# EAGLE design Controller V1.1 (EAGLE 8.4.1)
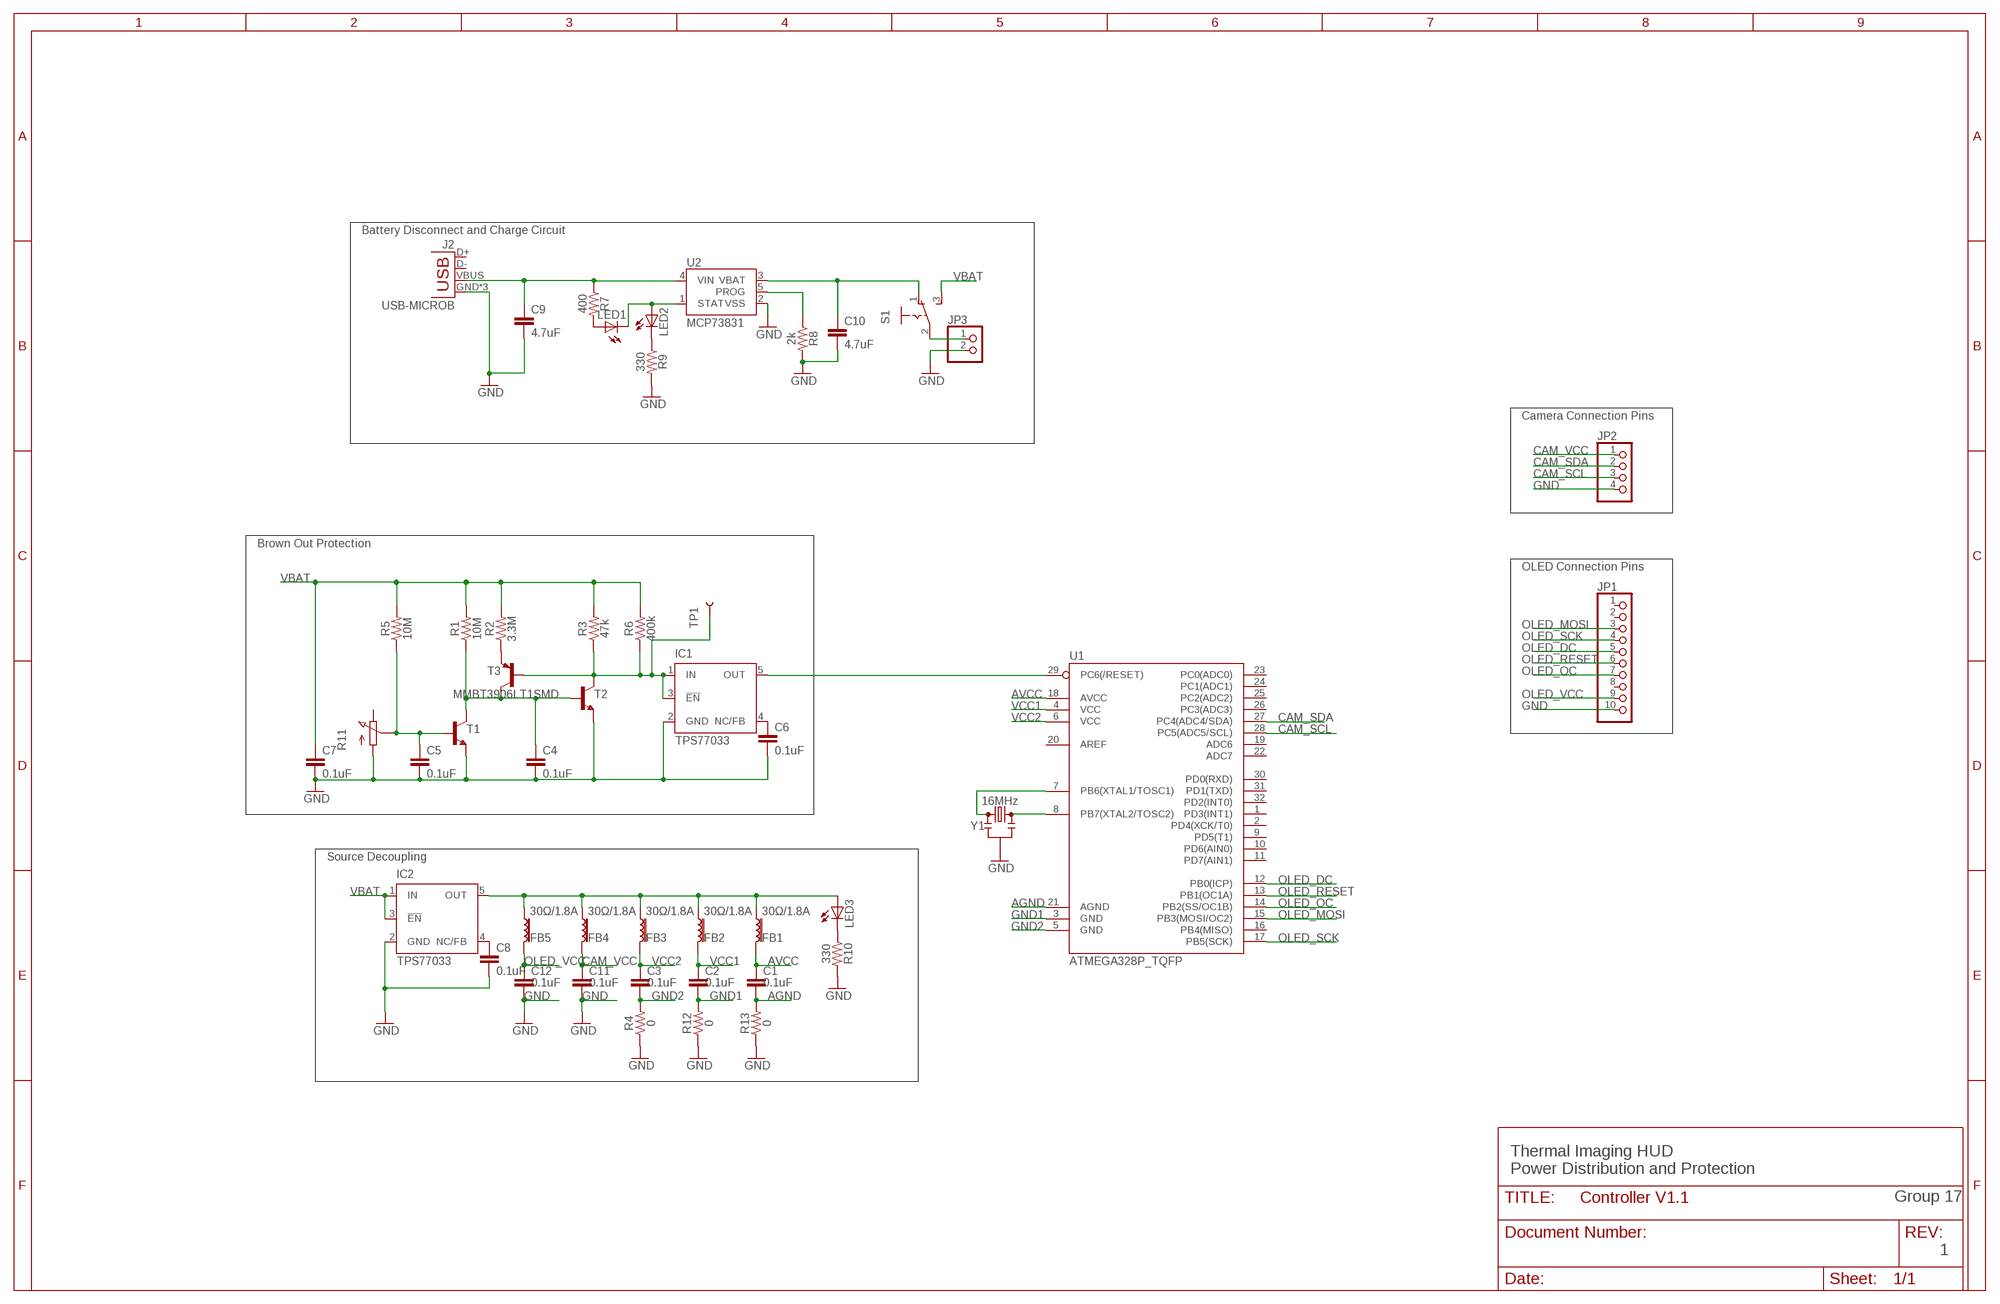
[diagram p0: schematic, sheet 1]

## Parts
C1  0.1uF  0.1UF-0603-25V-5%  [0603]
C2  0.1uF  0.1UF-0603-25V-5%  [0603]
C3  0.1uF  0.1UF-0603-25V-5%  [0603]
C4  0.1uF  0.1UF-0603-25V-5%  [0603]
C5  0.1uF  0.1UF-0603-25V-5%  [0603]
C6  0.1uF  0.1UF-0603-25V-5%  [0603]
C7  0.1uF  0.1UF-0603-25V-5%  [0603]
C8  0.1uF  0.1UF-0603-25V-5%  [0603]
C9  4.7uF  0.1UF-0603-25V-5%  [0603]
C10  4.7uF  0.1UF-0603-25V-5%  [0603]
C11  0.1uF  0.1UF-0603-25V-5%  [0603]
C12  0.1uF  0.1UF-0603-25V-5%  [0603]
FB1  30Ω/1.8A  FERRITE_BEAD-0603  [0603]
FB2  30Ω/1.8A  FERRITE_BEAD-0603  [0603]
FB3  30Ω/1.8A  FERRITE_BEAD-0603  [0603]
FB4  30Ω/1.8A  FERRITE_BEAD-0603  [0603]
FB5  30Ω/1.8A  FERRITE_BEAD-0603  [0603]
IC1  TPS77033  [SOT23-DBV]
IC2  TPS77033  [SOT23-DBV]
J2  USB-MICROB  [USB-MICROB]
JP1  PINHD-1X10/90  [1X10/90]
JP2  PINHD-1X4/90  [1X04/90]
JP3  PINHD-1X2/90  [1X02/90]
LED1  LS_T679-D2E2-1  [PLCC2]
LED2  LG_T679-E1F1-1  [PLCC2]
LED3  LG_T679-E1F1-1  [PLCC2]
R1  10M  10MOHM-0603-1/10W-5%  [0603]
R2  3.3M  10MOHM-0603-1/10W-5%  [0603]
R3  47k  10MOHM-0603-1/10W-5%  [0603]
R4  0  0OHM-0603-1/10W-5%  [0603]
R5  10M  10MOHM-0603-1/10W-5%  [0603]
R6  400k  10MOHM-0603-1/10W-5%  [0603]
R7  400  10MOHM-0603-1/10W-5%  [0603]
R8  2k  10MOHM-0603-1/10W-5%  [0603]
R9  330  10MOHM-0603-1/10W-5%  [0603]
R10  330  10MOHM-0603-1/10W-5%  [0603]
R11  PC25  [PC25]
R12  0  0OHM-0603-1/10W-5%  [0603]
R13  0  0OHM-0603-1/10W-5%  [0603]
S1  255SB  [255SB]
T1  MMBT3904LT1-NPN-SOT23-BEC  [SOT23-BEC]
T2  MMBT3904LT1-NPN-SOT23-BEC  [SOT23-BEC]
T3  MMBT3906LT1SMD  [SOT23-BEC]
TP1  TEST-POINT3X5  [PAD.03X.05]
U1  ATMEGA328P_TQFP  [TQFP32-08]
U2  MCP73831  [SOT23-5]
Y1  16MHz  RESONATOR-16MHZSMD_3.2X1.3  [RESONATOR-SMD-3.2X1.3]

## Nets
AGND: C1.2 R13.2 U1.21(AGND)
AVCC: C1.1 FB1.2 U1.18(AVCC)
CAM_SCL: JP2.3 U1.28(PC5(ADC5/SCL))
CAM_SDA: JP2.2 U1.27(PC4(ADC4/SDA))
CAM_VCC: C11.1 FB4.2 JP2.1
GND: C4.2 C5.2 C6.2 C7.2 C8.2 C9.2 C10.2 C11.2 C12.2 IC1.2(GND) IC2.2(GND) J2.GND J2.MT1(GND) J2.MT2(GND) JP1.10 JP2.4 JP3.2 R4.1 R8.2 R9.2 R10.2 R11.A R12.1 R13.1 T1.E T2.E U2.2(VSS) Y1.2
GND1: C2.2 R12.2 U1.3(GND)
GND2: C3.2 R4.2 U1.5(GND)
LIPO_POS: JP3.1 S1.2(P)
N$1: IC1.1(IN) IC1.3(!EN) R3.1 R6.1 T2.C T3.B TP1.P$1
N$2: C5.1 R5.1 R11.S T1.B
N$3: IC1.5(OUT) U1.29(PC6(/RESET))
N$4: C4.1 R1.1 T1.C T2.B T3.C
N$5: R2.1 T3.E
N$6: LED1.C LED2.A U2.1(STAT)
N$7: C6.1 IC1.4(NC/FB)
N$8: FB1.1 FB2.1 FB3.1 FB4.1 FB5.1 IC2.5(OUT) LED3.A
N$9: C8.1 IC2.4(NC/FB)
N$10: LED1.A R7.2
N$11: C9.1 J2.VBUS R7.1 U2.4(VIN)
N$12: R8.1 U2.5(PROG)
N$13: C10.1 S1.1(O) U2.3(VBAT)
N$15: U1.7(PB6(XTAL1/TOSC1)) Y1.1
N$16: U1.8(PB7(XTAL2/TOSC2)) Y1.3
N$17: LED3.C R10.1
N$18: LED2.C R9.1
OLED_DC: JP1.5 U1.12(PB0(ICP))
OLED_MOSI: JP1.3 U1.15(PB3(MOSI/OC2))
OLED_OC: JP1.7 U1.14(PB2(SS/OC1B))
OLED_RESET: JP1.6 U1.13(PB1(OC1A))
OLED_SCK: JP1.4 U1.17(PB5(SCK))
OLED_VCC: C12.1 FB5.2 JP1.9
VBAT: C7.1 IC2.1(IN) IC2.3(!EN) R1.2 R2.2 R3.2 R5.2 R6.2 S1.3(S)
VCC1: C2.1 FB2.2 U1.4(VCC)
VCC2: C3.1 FB3.2 U1.6(VCC)
Unconnected: J2.D+ J2.D- JP1.1 JP1.2 JP1.8 R11.E U1.1(PD3(INT1)) U1.2(PD4(XCK/T0)) U1.9(PD5(T1)) U1.10(PD6(AIN0)) U1.11(PD7(AIN1)) U1.16(PB4(MISO)) U1.19(ADC6) U1.20(AREF) U1.22(ADC7) U1.23(PC0(ADC0)) U1.24(PC1(ADC1)) U1.25(PC2(ADC2)) U1.26(PC3(ADC3)) U1.30(PD0(RXD)) U1.31(PD1(TXD)) U1.32(PD2(INT0))

## Notes on the sheet
- Battery Disconnect and Charge Circuit
- Camera Connection Pins
- Brown Out Protection
- OLED Connection Pins
- Source Decoupling
- Thermal Imaging HUD
  Power Distribution and Protection
- Group 17
- 1

## Library data of the parts
C1-C8 C11 C12 = SparkFun-Capacitors:0.1UF: 0.1µF ceramic capacitors A capacitor is a passive two-terminal electrical component used to store electrical energy temporarily in an electric field.; PROD_ID: CAP-08604
C9 C10 = SparkFun-Capacitors:0.1UF: 0.1µF ceramic capacitors A capacitor is a passive two-terminal electrical component used to store electrical energy temporarily in an electric field.; PROD_ID: CAP-08604; VALUE: 0.1uF
FB1-FB5 = SparkFun-Coils:FERRITE_BEAD: Ferrite Bead (blocks, cores, rings, chokes, etc.) Inductor with layers of ferrite used to suppress high frequencies. Often used to isolate high frequency noise. SparkFun Products: IOIO-OTG - V2.2 <https://www.sparkfun.com/products/13613> SparkFun SAMD21 Mini Breakout <https://www.sparkfun.com/products/13664> SparkFun 6 Degrees of Freedom Breakout - LSM6DS3 <https://www.sparkfun.com/products/13339> SparkFun SAMD21 Dev Breakout <https://www.sparkfun.com/products/13672>; PROD_ID: NDUC-07859
IC1 IC2 = texas:TPS770*: ULTRALOW-POWER 50-mA LOW-DROPOUT LINEAR REGULATORS 50-mA Low-Dropout Regulator Source: http://focus.ti.com/lit/ds/symlink/tps77001.pdf; MF: TEXAS INSTRUMENTS; MPN: TPS77033DBVT; OC_FARNELL: 8461570; OC_NEWARK: 77C1187
J2 = SparkFun-Retired:USB: USB Connectors USB-B-PTH is fully proven SKU : PRT-00139/CONN-08278 USB-miniB is fully proven SKU : PRT-00587 USB-A-PCB is untested. USB-A-H is throughly reviewed, but untested. Spark Fun Electronics SKU : PRT-00437 USB-B-SMT is throughly reviewed, but untested. Needs silkscreen touching up. USB-A-S has not been used/tested USB-MB-H has not been used/tested USB-MICROB has been used. CONN-09505; PROD_ID: CONN-09505
JP1 = pinhead:PINHD-1X10: PIN HEADER
JP2 = pinhead:PINHD-1X4: PIN HEADER
JP3 = pinhead:PINHD-1X2: PIN HEADER
LED1 = led:*_T679-?-1: LC TOPLED® Low Current LED Source: http://catalog.osram-os.com .. LG_LS_LY_T679_OBS.pdf; COLOR: super-red
LED2 LED3 = led:*_T679-?-1: LC TOPLED® Low Current LED Source: http://catalog.osram-os.com .. LG_LS_LY_T679_OBS.pdf; COLOR: green
R1 R5 = SparkFun-Resistors:10MOHM: RES-09327; PROD_ID: RES-08283
R2 R3 R6-R10 = SparkFun-Resistors:10MOHM: RES-09327; PROD_ID: RES-08283; VALUE: 10M
R4 R12 R13 = SparkFun-Resistors:0OHM: 0Ω resistor A resistor is a passive two-terminal electrical component that implements electrical resistance as a circuit element. Resistors act to reduce current flow, and, at the same time, act to lower voltage levels within circuits. - Wikipedia; PROD_ID: RES-08609
R11 = pot-vitrohm:PC25: VITROHM POTENTIOMETER; MF: CLAROSTAT; MPN: 308NPC25KS; OC_FARNELL: 1440998; OC_NEWARK: 03F7518
S1 = switch:255SB: SLIDING SWITCH Distributor Buerklin, 11G810
T1 T2 = transistor-neu-to92:*-NPN-: NPN Transistror
T3 = transistor-pnp:MMBT3906*: PNP Transistror
TP1 = SparkFun-Connectors:TEST-POINT: SparkFun Test Points Bare copper test points for troubleshooting or In-Circuit-Testing. These are used by our Production team for verifying production board runs using pogo-pins on test beds. SparkFun Products: SparkFun LSM9DS1 Breakout <https://www.sparkfun.com/products/13284> SparkFun PSOC <https://www.sparkfun.com/products/13714> SparkFun Load Cell Amplifier <https://www.sparkfun.com/products/13879>
U1 = SparkFun-IC-Microcontroller:ATMEGA328P_TQFP: Popular 328P in QFP Storefront component: ATmega328 - TQFP <https://www.sparkfun.com/products/13448> (COM-13448) Datasheet <http://www.sparkfun.com/datasheets/Components/SMD/ATMega328.pdf> SparkFun Products SparkFun RedBoard - Programmed with Arduino <https://www.sparkfun.com/products/12757> (DEV-12757) Arduino Pro Mini 328 - 5V/16MHz <https://www.sparkfun.com/products/11113> (DEV-11113) Arduino Pro Mini 328 - 3.3V/8MHz <https://www.sparkfun.com/products/11114> (DEV-11114) SparkFun OpenLog <https://www.sparkfun.com/products/13712> (DEV-13712) SparkFun MicroView - OLED Arduino Module <https://www.sparkfun.com/products/12923> (DEV-12923) SparkFun Digital Sandbox <https://www.sparkfun.com/products/12651> (DEV-12651) SparkFun PicoBoard <https://www.sparkfun.com/products/11888> (WIG-11888) Arduino Fio <https://www.sparkfun.com/products/10116> (DEV-10116) LilyPad Arduino 328 Main Board <https://www.sparkfun.com/products/13342> (DEV-13342) SparkFun RedStick <https://www.sparkfun.com/products/13741> (DEV-13741) LilyPad MP3 <https://www.sparkfun.com/products/11013> (DEV-11013) LilyPad Arduino SimpleSnap <https://www.sparkfun.com/products/10941> (DEV-10941) SparkFun Stepoko <https://www.sparkfun.com/products/13899> (ROB-13899) SparkFun Geiger Counter <https://www.sparkfun.com/products/11345> (SEN-11345) SparkFun EL Sequencer <https://www.sparkfun.com/products/12781> (COM-12781) Arduino Pro 328 - 5V/16MHz <https://www.sparkfun.com/products/10915> (DEV-10915) CryptoCape <https://www.sparkfun.com/products/12773> (DEV-12773) SparkFun IR Thermometer Evaluation Board - MLX90614 <https://www.sparkfun.com/products/10740> (SEN-10740) SparkFun RedBot Mainboard <https://www.sparkfun.com/products/12097> (ROB-12097) Arduino Pro 328 - 3.3V/8MHz <https://www.sparkfun.com/products/10914> (DEV-10914) SparkFun Block for Intel® Edison - Arduino <https://www.sparkfun.com/products/13036> (DEV-13036) SparkFun Simon Says - Surface Mount Soldering Kit <https://www.sparkfun.com/products/10935> (KIT-10935) SparkFun 7-Segment Serial Display - Red <https://www.sparkfun.com/products/11441> (COM-11441) SparkFun 7-Segment Serial Display - White <https://www.sparkfun.com/products/11629> (COM-11629) SparkFun 7-Segment Serial Display - Yellow <https://www.sparkfun.com/products/11443> (COM-11443) SparkFun 7-Segment Serial Display - Kelly Green <https://www.sparkfun.com/products/11440> (COM-11440) SparkFun 7-Segment Serial Display - Blue <https://www.sparkfun.com/products/11442> (COM-11442) SparkFun OpenSegment Serial Display - 20mm (Blue) <https://www.sparkfun.com/products/11647> (COM-11647) SparkFun OpenSegment Serial Display - 20mm (Green) <https://www.sparkfun.com/products/11646> (COM-11646) SparkFun OpenSegment Serial Display - 20mm (White) <https://www.sparkfun.com/products/11648> (COM-11648) SparkFun OpenSegment Serial Display - 20mm (Red) <https://www.sparkfun.com/products/11644> (COM-11644) SparkFun OpenSegment Serial Display - 20mm (Yellow) <https://www.sparkfun.com/products/11645> (COM-11645) SparkFun OpenSegment Shield <https://www.sparkfun.com/products/13190> (DEV-13190); PROD_ID: IC-09069
U2 = SparkFun-IC-Power:MCP73831: MCP73831T Li-Ion, Li-Pol Controller Miniature single cell, fully integrated Li-Ion, Li-polymer charge management controller Datasheet <http://ww1.microchip.com/downloads/en/DeviceDoc/20001984g.pdf> SparkFun Products: SparkFun ESP32 Thing <https://www.sparkfun.com/products/13907> SparkFun 9DoF Razor IMU M0 <https://www.sparkfun.com/products/14001>; PROD_ID: IC-09995
Y1 = SparkFun-Clocks:RESONATOR-16MHZ: 16MHz Resonator Digikey Example <http://www.digikey.com/product-detail/en/murata-electronics-north-america/CSTCE16M0V53-R0/490-1198-1-ND/584635> Frequency: 16MHz Frequency Stability: ±0.3% Frequency Tolerance: ±0.5% Capacitance: 15pF SparkFun Products SparkFun OpenLog <https://www.sparkfun.com/products/13712> SparkFun MicroView - OLED Arduino Module <https://www.sparkfun.com/products/12923>; PROD_ID: XTAL-08900

## Board
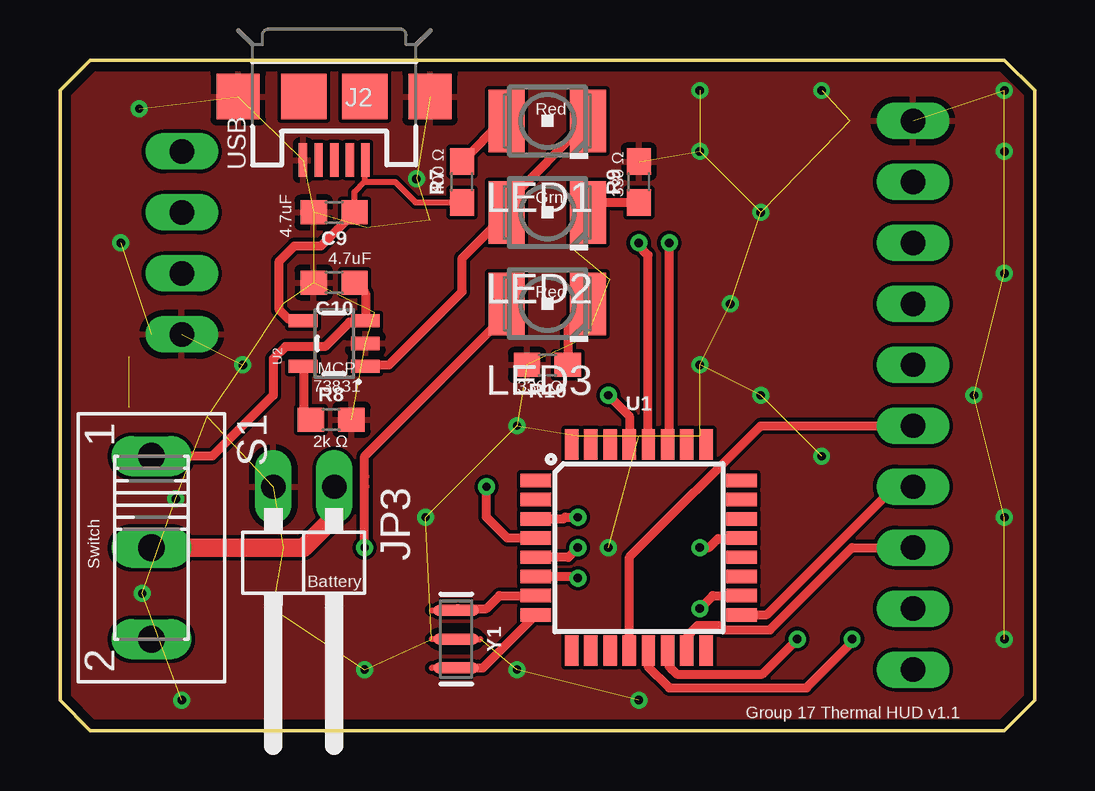
[diagram p1: board, top side]
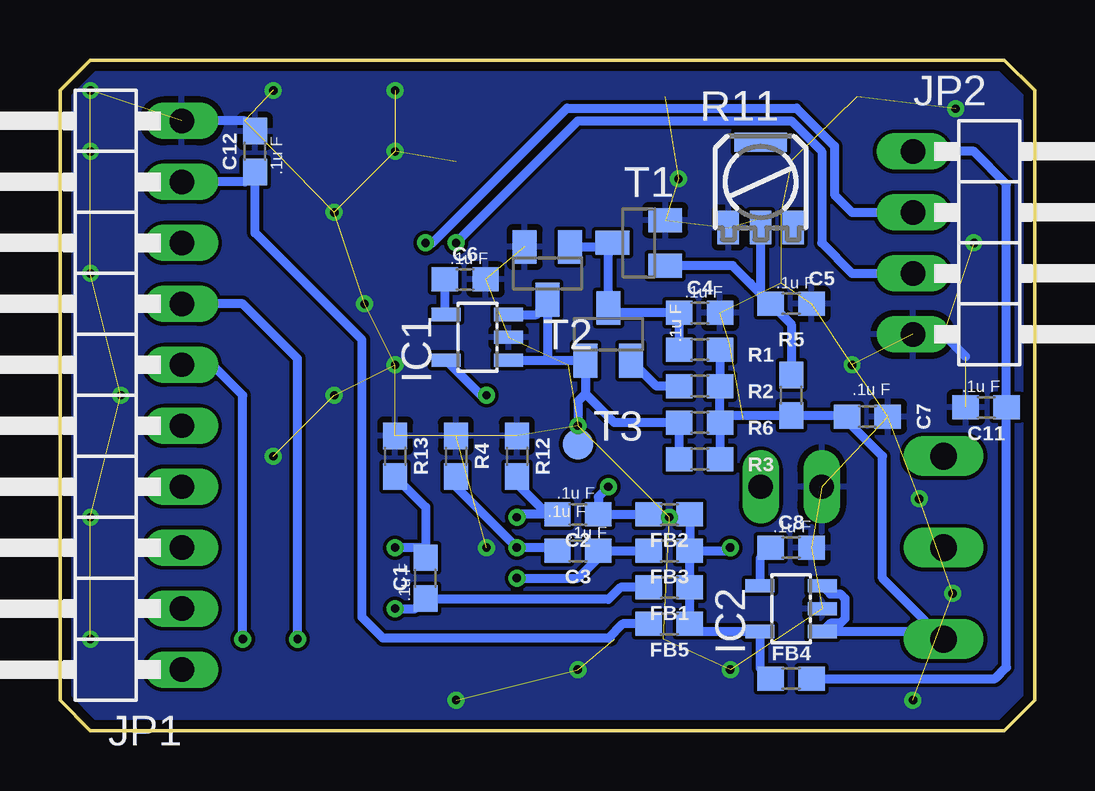
[diagram p2: board, bottom side, seen from below]

Size 40.64 x 27.94 mm. Coordinates in mm from the lower left corner, seen from the top.
Outline: 1.27,27.94 39.37,27.94 40.64,26.67 40.64,1.27 39.37,0 1.27,0 0,1.27 0,26.67 1.27,27.94
Copper layers (1*16): Top 0.0356mm / dielectric 1.5011mm / Bottom 0.0356mm
Design rules "oshpark-2layer": minimum track width 6mil, minimum drill 13mil, track to track 6mil, track to pad 6mil, pad to pad 6mil, via to via 6mil, smd to smd 6mil, copper to edge 15mil, drill to drill 6mil, minimum pad ring 7mil, minimum via ring 7mil, stop-mask expansion 2.5mil, vias tented up to drill 0mil, thermal gap 10mil

### Footprints (pad centres in the part's own frame; a part is rotated, then mirrored left to right if it is on the bottom)
0603 = smd 1.1 x 1: 1 -0.85,0; 2 0.85,0
SOT23-DBV = smd 0.55 x 1.2: 1 -0.95,-1.3; 2 0,-1.3; 3 0.95,-1.3; 4 0.95,1.3; 5 -0.95,1.3
USB-MICROB = smd 0.35 x 1.4: D+ 0,2.65; D- -0.65,2.65; GND 1.3,2.65; ID 0.65,2.65; VBUS -1.3,2.65 | smd 1.8 x 1.9: MT1 -4,0; MT2 4,0 | smd 1.9 x 1.9: P$1 -1.27,0; P$2 1.27,0
1X10/90 = drill 1.016 long: 1 -11.43,-3.81; 2 -8.89,-3.81; 3 -6.35,-3.81; 4 -3.81,-3.81; 5 -1.27,-3.81; 6 1.27,-3.81; 7 3.81,-3.81; 8 6.35,-3.81; 9 8.89,-3.81; 10 11.43,-3.81
1X04/90 = drill 1.016 long: 1 -3.81,-3.81; 2 -1.27,-3.81; 3 1.27,-3.81; 4 3.81,-3.81
1X02/90 = drill 1.016 long: 1 -1.27,-3.81; 2 1.27,-3.81
PLCC2 = smd 2.6 x 1.5: A 0,1.7; C 0,-1.7
PC25 = smd 2.2 x 0.8: 4 0,1.65 | smd 0.9 x 1.4: A -1.35,-1.9; E 1.35,-1.9; S 0,-1.9
255SB = drill 1.118 long: 1 -3.81,0; 2 0,0; 3 3.81,0
SOT23-BEC = smd 1 x 1.4: B -0.95,-1.1; C 0,1.1; E 0.95,-1.1
PAD.03X.05 = smd 1.27 x 1.27: P$1 0,0
TQFP32-08 = smd 1.27 x 0.559: 1 -4.293,2.8; 2 -4.293,2; 3 -4.293,1.2; 4 -4.293,0.4; 5 -4.293,-0.4; 6 -4.293,-1.2; 7 -4.293,-2; 8 -4.293,-2.8; 17 4.293,-2.8; 18 4.293,-2; 19 4.293,-1.2; 20 4.293,-0.4; 21 4.293,0.4; 22 4.293,1.2; 23 4.293,2; 24 4.293,2.8 | smd 0.559 x 1.27: 9 -2.8,-4.293; 10 -2,-4.293; 11 -1.2,-4.293; 12 -0.4,-4.293; 13 0.4,-4.293; 14 1.2,-4.293; 15 2,-4.293; 16 2.8,-4.293; 25 2.8,4.293; 26 2,4.293; 27 1.2,4.293; 28 0.4,4.293; 29 -0.4,4.293; 30 -1.2,4.293; 31 -2,4.293; 32 -2.8,4.293
SOT23-5 = smd 0.55 x 1.2: 1 -0.95,-1.3; 2 0,-1.3; 3 0.95,-1.3; 4 0.95,1.3; 5 -0.95,1.3
RESONATOR-SMD-3.2X1.3 = smd 0.45 x 1.905: 1 -1.2,0; 2 0,0; 3 1.2,0

### Placement (x,y rotation side)
C1  25.4,6.35 90 bottom
C2  19.05,9.02 180 bottom
C3  19.05,7.49 180 bottom
C4  13.97,17.4 0 bottom
C5  10.16,17.78 0 bottom
C6  23.75,18.8 0 bottom
C7  6.98,13.08 0 bottom
C8  10.16,7.62 0 bottom
C9  11.43,21.59 180 top
C10  11.43,18.67 180 top
C11  2.03,13.46 180 bottom
C12  32.51,24.13 90 bottom
FB1  15.24,5.97 180 bottom
FB2  15.24,9.02 180 bottom
FB3  15.24,7.49 180 bottom
FB4  10.16,2.16 0 bottom
FB5  15.24,4.45 180 bottom
IC1  23.24,16.38 90 bottom
IC2  10.16,5.08 90 bottom
J2  11.43,26.42 180 top
JP1  39.37,13.97 90 bottom
JP2  1.27,20.32 270 bottom
JP3  10.16,6.35 180 top
LED1  20.32,25.4 90 top
LED2  20.32,21.59 90 top
LED3  20.32,17.78 90 top
R1  13.97,15.88 0 bottom
R2  13.97,14.35 0 bottom
R3  13.97,11.3 0 bottom
R4  24.13,11.43 270 bottom
R5  10.16,13.97 270 bottom
R6  13.97,12.83 0 bottom
R7  16.76,22.86 90 top
R8  11.3,12.95 0 top
R9  24.13,22.86 90 top
R10  20.32,15.24 180 top
R11  11.43,22.86 0 bottom
R12  21.59,11.43 270 bottom
R13  26.67,11.43 270 bottom
S1  3.81,7.62 270 top
T1  16.51,20.32 90 bottom
T2  20.32,19.05 180 bottom
T3  17.78,16.51 0 bottom
TP1  19.05,11.94 0 bottom
U1  24.13,7.62 0 top
U2  11.43,16.13 90 top
Y1  16.51,3.81 270 top

### Tracks (layer width: path | path; a pad name or v marks a point on that pad's centre or on a via)
AGND  (via drill 0.35)
  Top 0.381: v26.67,7.62 27.05,7.62 27.43,8 28.4,8 U1.21
  Bottom 0.381: 25.4,7.62 25.4,9.31 R13.2 | 25.4,7.62 C1.2 | 25.4,7.62 v26.67,7.62
AVCC  (via drill 0.35 pad 0.55)
  Top 0.381: U1.18 27.21,5.62 v26.67,5.08
  Bottom 0.381: v26.67,5.08 25.82,5.08 C1.1 25.36,5.46 17.78,5.46 17.27,5.97 FB1.2
CAM_SCL  (via drill 0.35)
  Top 0.381: U1.28 24.51,11.93 24.51,19.81 24.13,20.19 v24.13,20.32
  Bottom 0.381: v24.13,20.32 19.05,25.4 10.16,25.4 8.89,24.13 8.89,20.32 7.62,19.05 JP2.3
CAM_SDA  (via drill 0.35)
  Top 0.381: U1.27 25.4,11.98 v25.4,20.32
  Bottom 0.381: v25.4,20.32 25.11,20.32 19.5,25.93 9.94,25.93 8.36,24.35 8.36,22.33 7.62,21.59 JP2.2
CAM_VCC
  Bottom 0.381: FB4.2 1.65,2.16 1.18,2.63 C11.1 1.18,22.77 2.54,24.13 JP2.1
GND  (via drill 0.35)  (54 unrouted)
  Bottom 0.381: 2.88,15.58 3.81,16.51 JP2.4 | 32.93,25.4 JP1.10
  other vias: 26.67,26.67 31.75,26.67 39.37,26.67 39.37,24.13 39.37,19.05 39.37,8.89 39.37,3.81 38.1,13.97 27.94,17.78 14.86,22.99 15.24,8.89 19.05,12.7 26.67,15.24 29.21,21.59 26.67,24.13 29.21,13.97 31.75,11.43 22.86,7.62 19.05,2.54 24.13,1.27 12.7,2.54 5.08,1.27 3.43,5.71 4.83,9.65 7.62,15.24 2.54,20.32 3.3,25.91
  pour Bottom: 0,26.67 0,1.27 1.27,0 39.37,0 40.64,1.27 40.64,26.67 39.37,27.94 1.27,27.94
  pour Top: 1.27,0 39.37,0 40.64,1.27 40.64,26.67 39.37,27.94 1.27,27.94 0,26.67 0,1.27
GND1  (via drill 0.35)
  Top 0.152: 20.98,8.82 21.05,8.89
  Top 0.381: U1.3 20.98,8.82 | 21.05,8.89 v21.59,8.89
  Bottom 0.381: 20.32,9.02 C2.2 | 20.32,9.02 21.46,9.02 v21.59,8.89 | R12.2 21.59,10.29 20.32,9.02
GND2  (via drill 0.35 pad 0.55)
  Top 0.381: v21.59,7.62 21.19,7.22 U1.5
  Bottom 0.381: v21.59,7.62 21.46,7.49 | C3.2 20.03,7.62 v21.59,7.62 | R4.2 24.13,10.16 v21.59,7.62
LIPO_POS
  Top 0.762: S1.2 10.16,7.62 11.43,8.89 JP3.1
N$1
  Bottom 0.381: R3.1 R6.1 17.53,12.83 18.73,14.03 | 20.32,15.41 T3.B 18.73,14.03 | 20.32,17.78 20.32,15.41 | 20.32,17.78 T2.C | 18.73,14.03 19.05,13.71 TP1.P$1 | 20.32,15.41 21.92,15.41 IC1.1 | IC1.3 20.77,17.33 20.32,17.78
N$2
  Bottom 0.381: C5.1 11.43,18.2 R11.S | C5.1 11.33,18.1 | C5.1 10.16,16.93 R5.1 | C5.1 11.86,18.62 11.88,18.65 12.6,19.37 T1.B
N$3  (via drill 0.35)
  Top 0.381: v22.86,13.97 23.73,13.1 U1.29
  Bottom 0.381: IC1.5 23.08,13.97 v22.86,13.97
N$4
  Bottom 0.381: R1.1 C4.1 17.57,17.4 T3.C 17.78,20.15 | T2.B 17.78,20.15 | T1.C 17.78,20.15
N$5
  Bottom 0.381: R2.1 15.77,14.35 T3.E
N$6
  Top 0.381: LED1.C 18.62,22 LED2.A 18.62,21.54 16.76,19.68 16.76,18.29 13.72,15.24 12.79,15.24 U2.1
N$7
  Bottom 0.381: C6.1 24.6,17.39 IC1.4
N$8  (via drill 0.35)
  Top 0.381: v12.7,7.62 12.7,10.16 | 12.7,10.16 12.7,10.59 | 12.7,10.16 12.7,11.43 18.62,17.35 LED3.A
  Bottom 0.381: FB2.1 FB3.1 | FB3.1 FB1.1 FB5.1 14.07,4.13 IC2.5 11.46,2.61 FB4.1 | FB3.1 12.83,7.49 v12.7,7.62
N$9
  Bottom 0.381: C8.1 11.46,7.17 IC2.4
N$10
  Top 0.381: R7.2 18.45,25.4 LED1.A
N$11
  Top 0.254: J2.VBUS 12.7,23.74 12.7,22.86 | 12.7,22.86 12.28,22.44 C9.1 | 12.7,22.86 13.97,22.86 14.82,22.01 R7.1
  Top 0.381: U2.4 10.06,17.14 9.53,17.14 9.14,17.53 9.14,19.56 9.78,20.19 10.88,20.19 C9.1
N$12
  Top 0.381: U2.5 10.16,15.15 10.16,12.7 10.41,12.95 R8.1
N$13
  Top 0.381: C10.1 12.73,18.22 U2.3 12.67,17.02 12.06,17.02 11.05,16 9.4,16 8.89,15.49 8.89,13.97 6.35,11.43 S1.1
N$15
  Top 0.381: Y1.1 16.58,5.08 17.78,5.08 18.32,5.62 U1.7
N$16
  Top 0.381: Y1.3 17.63,2.61 U1.8
N$17
  Top 0.381: LED3.C 21.17,16.93 R10.1
N$18
  Top 0.381: LED2.C 22.44,22.01 R9.1
OLED_DC
  Top 0.381: U1.12 23.75,3.35 23.75,7.24 29.21,12.7 JP1.5
OLED_MOSI
  Top 0.381: U1.15 26.16,3.36 26.16,3.94 26.31,4.08 26.31,4.1 26.59,4.38 27.46,4.38 27.65,4.2 29.6,4.2 33.02,7.62 JP1.3
OLED_OC  (via drill 0.35)
  Top 0.381: U1.14 25.4,3.26 25.4,2.67 25.51,2.56 25.51,2.55 25.71,2.35 29.27,2.35 v30.73,3.81
  Bottom 0.381: v30.73,3.81 30.73,15.49 33.02,17.78 JP1.7
OLED_RESET  (via drill 0.35)
  Top 0.381: U1.13 24.53,2.69 24.51,2.67 25.4,1.78 31.11,1.78 33.02,3.68 v33.02,3.81
  Bottom 0.381: v33.02,3.81 33.02,13.97 34.29,15.24 JP1.6
OLED_SCK
  Top 0.381: U1.17 29.46,4.83 34.8,10.16 JP1.4
OLED_VCC
  Bottom 0.381: 17.78,3.85 27.18,3.85 28.05,4.72 28.05,16.28 32.51,20.74 C12.1 32.93,22.86 JP1.9 | 17.78,3.85 17.7,3.85 | 17.78,3.85 17.19,4.45 FB5.2
VBAT
  Bottom 0.381: R1.2 R2.2 R6.2 | R6.2 R3.2 | R6.2 12.7,13.12 R5.2 7.87,13.12 C7.1 7.84,12.91 6.35,11.43 6.35,6.35 S1.3 4.13,4.13 IC2.1 8.53,4.46 8.12,4.46 7.92,4.66 7.92,5.5 8.12,5.7 8.53,5.7 IC2.3
VCC1  (via drill 0.35 pad 0.55)
  Top 0.381: U1.4 18.65,8.02 17.78,8.89 v17.78,10.16
  Bottom 0.381: FB2.2 C2.1 18.2,9.74 v17.78,10.16
VCC2  (via drill 0.35 pad 0.55)
  Top 0.381: U1.6 21.52,6.42 v21.59,6.35
  Bottom 0.381: v21.59,6.35 19.05,6.35 18.2,7.2 C3.1 FB3.2

### Text on the board
tPlace: Red | USB | 4.7uF | 400 Ω | Grn | 330 Ω | 4.7uF | Red | 330 Ω | MCP / 73831 | 2k Ω | Switch | Battery | Group 17 Thermal HUD v1.1
bPlace: .1u F | .1u F | .1u F | .1u F | .1u F | .1u F | .1u F | .1u F | .1u F | .1u F | .1u F | .1u F | .1u F